# EAGLE schematic bk-circ5-S (EAGLE 9.1.0)
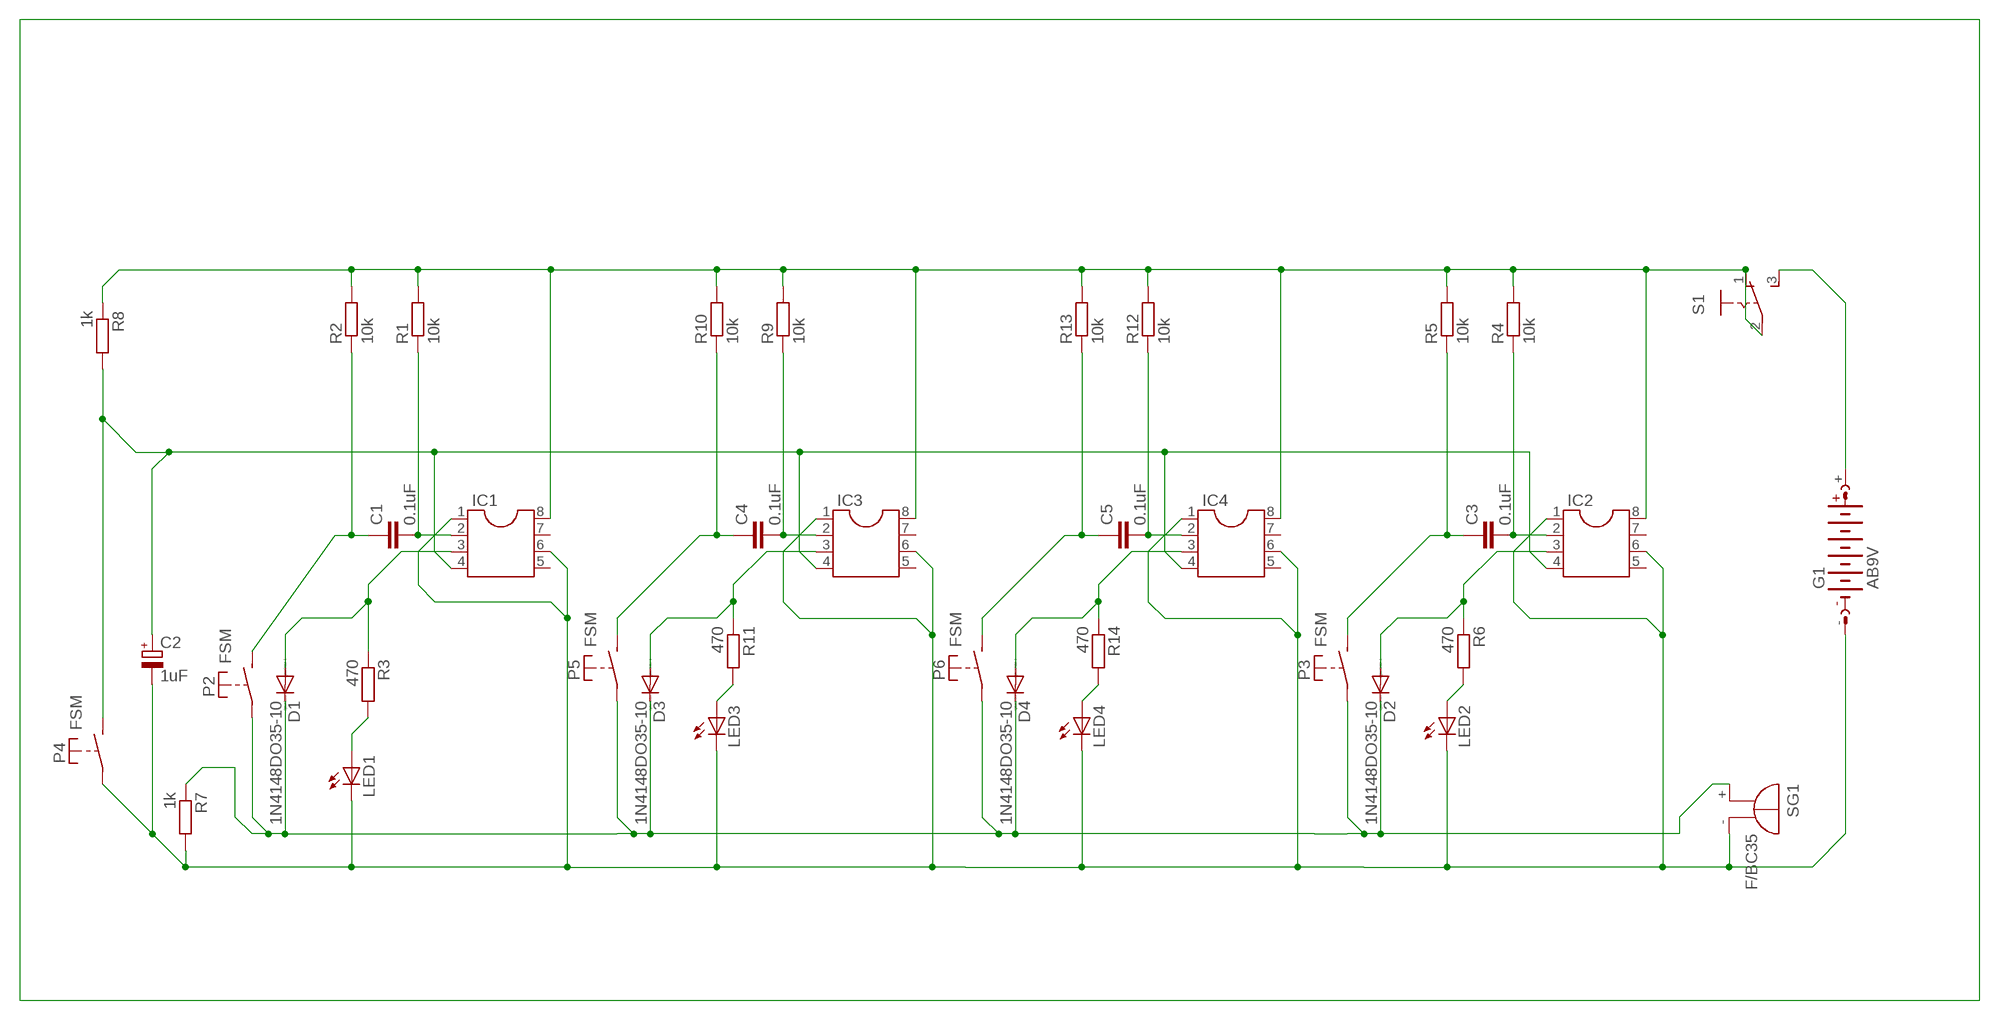
[diagram p0: schematic, sheet 1]

## Parts
C1  0.1uF  C-EU050-035X075  [C050-035X075]
C2  1uF  CPOL-EUB45181B  [B45181B]
C3  0.1uF  C-EU050-035X075  [C050-035X075]
C4  0.1uF  C-EU050-035X075  [C050-035X075]
C5  0.1uF  C-EU050-035X075  [C050-035X075]
D1  1N4148DO35-10  [DO35-10]
D2  1N4148DO35-10  [DO35-10]
D3  1N4148DO35-10  [DO35-10]
D4  1N4148DO35-10  [DO35-10]
G1  AB9V  [AB9V]
IC1  DIL8  [DIL08]
IC2  DIL8  [DIL08]
IC3  DIL8  [DIL08]
IC4  DIL8  [DIL08]
LED1  LED3MM  [LED3MM]
LED2  LED3MM  [LED3MM]
LED3  LED3MM  [LED3MM]
LED4  LED3MM  [LED3MM]
P2  FSM  [FSM]
P3  FSM  [FSM]
P4  FSM  [FSM]
P5  FSM  [FSM]
P6  FSM  [FSM]
R1  10k  R-EU_0411/12  [0411/12]
R2  10k  R-EU_0411/12  [0411/12]
R3  470  R-EU_0411/12  [0411/12]
R4  10k  R-EU_0411/12  [0411/12]
R5  10k  R-EU_0411/12  [0411/12]
R6  470  R-EU_0411/12  [0411/12]
R7  1k  R-EU_0411/12  [0411/12]
R8  1k  R-EU_0411/12  [0411/12]
R9  10k  R-EU_0411/12  [0411/12]
R10  10k  R-EU_0411/12  [0411/12]
R11  470  R-EU_0411/12  [0411/12]
R12  10k  R-EU_0411/12  [0411/12]
R13  10k  R-EU_0411/12  [0411/12]
R14  470  R-EU_0411/12  [0411/12]
S1  255SB  [255SB]
SG1  F/BC35  [F/BC35]

## Nets
N$1: C1.2 IC1.2 R1.1
N$3: LED1.A R3.2
N$4: C1.1 P2.P$2(S) R2.1
N$5: IC1.8 IC2.8 IC3.8 IC4.8 R1.2 R2.2 R4.2 R5.2 R8.1 R9.2 R10.2 R12.2 R13.2 S1.1(O) S1.2(P)
N$6: G1.+ S1.3(S)
N$7: C3.2 IC2.2 R4.1
N$9: LED2.A R6.2
N$10: C3.1 P3.P$2(S) R5.1
N$13: IC1.1
N$14: IC2.1
N$15: C2.+ IC1.4 IC2.4 IC3.4 IC4.4 P4.P$2(S) R8.2
N$17: C2.- D1.A D2.A D3.A D4.A G1.- IC1.3 IC1.6 IC2.3 IC2.6 IC3.3 IC3.6 IC4.3 IC4.6 LED1.K(C) LED2.K(C) LED3.K(C) LED4.K(C) P4.P$1(P) R3.1 R6.1 R7.2 R11.1 R14.1 SG1.-
N$20: C4.2 IC3.2 R9.1
N$21: C4.1 P5.P$2(S) R10.1
N$22: LED3.A R11.2
N$24: IC3.1
N$28: C5.2 IC4.2 R12.1
N$29: C5.1 P6.P$2(S) R13.1
N$30: LED4.A R14.2
N$31: D1.C D2.C D3.C D4.C P2.P$1(P) P3.P$1(P) P5.P$1(P) P6.P$1(P) R7.1 SG1.+
N$32: IC4.1
Unconnected: IC1.5 IC1.7 IC2.5 IC2.7 IC3.5 IC3.7 IC4.5 IC4.7

## Library data of the parts
C1 C3-C5 = resistor:C-EU: CAPACITOR, European symbol
C2 = resistor:CPOL-EU: POLARIZED CAPACITOR, European symbol
D1-D4 = diode:1N4148: DIODE high speed (Philips)
G1 = battery:AB9V: 9-V BATTERY CLIP
IC1-IC4 = ic-package:DIL8: Dual In Line / Socket
LED1-LED4 = led:LED: LED OSRAM: - CHIPLED LG R971, LG N971, LY N971, LG Q971, LY Q971, LO R971, LY R971 LH N974, LH R974 LS Q976, LO Q976, LY Q976 LO Q996 - Hyper CHIPLED LW Q18S LB Q993, LB Q99A, LB R99A - SideLED LS A670, LO A670, LY A670, LG A670, LP A670 LB A673, LV A673, LT A673, LW A673 LH A674 LY A675 LS A676, LA A676, LO A676, LY A676, LW A676 LS A679, LY A679, LG A679 - Hyper Micro SIDELED® LS Y876, LA Y876, LO Y876, LY Y876 LT Y87S - SmartLED LW L88C, LW L88S LB L89C, LB L89S, LG L890 LS L89K, LO L89K, LY L89K LS L896, LA L896, LO L896, LY L896 - TOPLED LS T670, LO T670, LY T670, LG T670, LP T670 LSG T670, LSP T670, LSY T670, LOP T670, LYG T670 LG T671, LOG T671, LSG T671 LB T673, LV T673, LT T673, LW T673 LH T674 LS T676, LA T676, LO T676, LY T676, LB T676, LH T676, LSB T676, LW T676 LB T67C, LV T67C, LT T67C, LS T67K, LO T67K, LY T67K, LW E67C LS E67B, LA E67B, LO E67B, LY E67B, LB E67C, LV E67C, LT E67C LW T67C LS T679, LY T679, LG T679 LS T770, LO T770, LY T770, LG T770, LP T770 LB T773, LV T773, LT T773, LW T773 LH T774 LS E675, LA E675, LY E675, LS T675 LS T776, LA T776, LO T776, LY T776, LB T776 LHGB T686 LT T68C, LB T68C - Hyper Mini TOPLED® LB M676 - Mini TOPLED Santana® LG M470 LS M47K, LO M47K, LY M47K Source: http://www.osram.convergy.de LUXEON: - LUMILED® LXK2-PW12-R00, LXK2-PW12-S00, LXK2-PW14-U00, LXK2-PW14-V00 LXK2-PM12-R00, LXK2-PM12-S00, LXK2-PM14-U00 LXK2-PE12-Q00, LXK2-PE12-R00, LXK2-PE12-S00, LXK2-PE14-T00, LXK2-PE14-U00 LXK2-PB12-K00, LXK2-PB12-L00, LXK2-PB12-M00, LXK2-PB14-N00, LXK2-PB14-P00, LXK2-PB14-Q00 LXK2-PR12-L00, LXK2-PR12-M00, LXK2-PR14-Q00, LXK2-PR14-R00 LXK2-PD12-Q00, LXK2-PD12-R00, LXK2-PD12-S00 LXK2-PH12-R00, LXK2-PH12-S00 LXK2-PL12-P00, LXK2-PL12-Q00, LXK2-PL12-R00 Source: www.luxeon.com KINGBRIGHT: KA-3528ASYC Source: www.kingbright.com
P2-P6 = switch-misc:FSM: TYCO SWITCH
R1-R14 = resistor:R-EU_: RESISTOR, European symbol
S1 = switch:255SB: SLIDING SWITCH Distributor Buerklin, 11G810
SG1 = buzzer:F/BC35: BUZZER Source: Spoerle; OC_FARNELL: unknown; OC_NEWARK: unknown